# Altium schematic sheet MCU.SchDoc
size A3; SheetNumber: 9; SheetTotal: 9
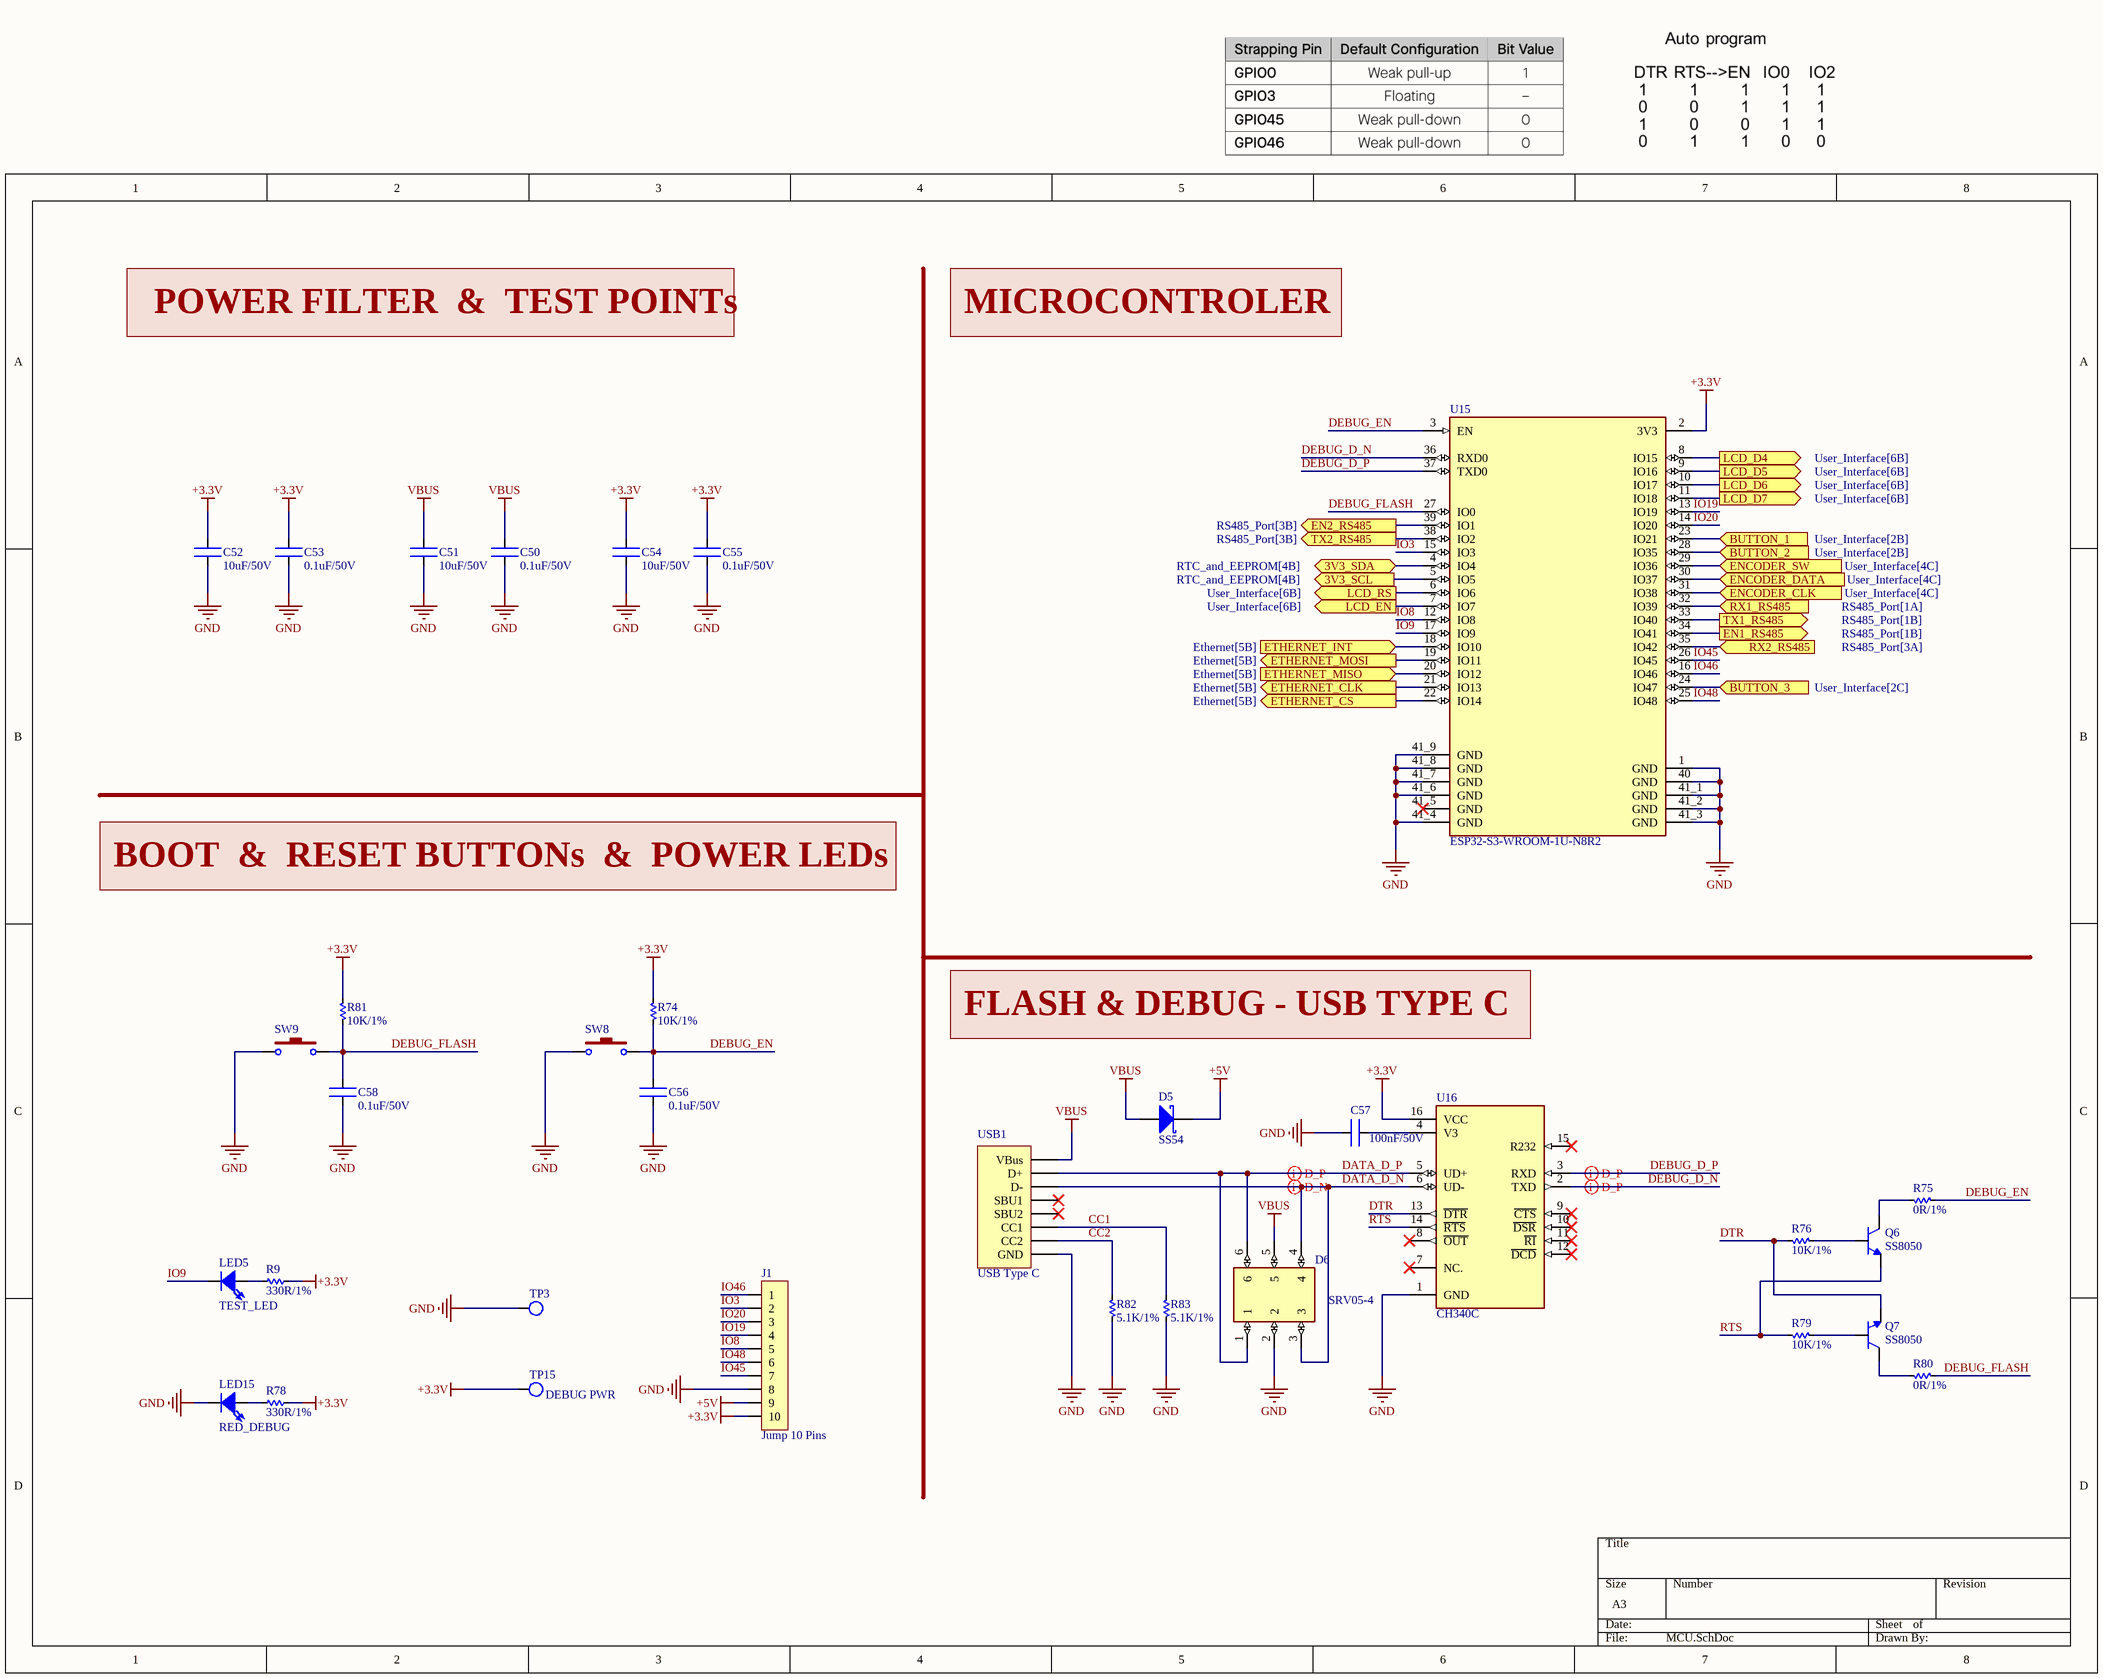
[diagram p0: MCU.SchDoc]

## Parts
C50  0.1uF/50V  [CAP - 0603]
C51  10uF/50V  [CAP - 0603]
C52  10uF/50V  [CAP - 0603]
C53  0.1uF/50V  [CAP - 0603]
C54  10uF/50V  [CAP - 0603]
C55  0.1uF/50V  [CAP - 0603]
C56  0.1uF/50V  [CAP - 0603]
C57  100nF/50V  [CAP - 0603]
C58  0.1uF/50V  [CAP - 0603]
D5  SS54  [SS54]
D6  SRV05-4  [SOT-23-6]
J1  Jump 10 Pins  [JPx1-10pins-2.54mm]
LED5  TEST_LED  [RED_LED_0603]
LED15  RED_DEBUG  [RED_LED_0603]
Q6  SS8050  [SOT23-3]
Q7  SS8050  [SOT23-3]
R9  330R/1%  [RES - 0603]
R74  10K/1%  [RES - 0603]
R75  0R/1%  [RES - 0603]
R76  10K/1%  [RES - 0603]
R78  330R/1%  [RES - 0603]
R79  10K/1%  [RES - 0603]
R80  0R/1%  [RES - 0603]
R81  10K/1%  [RES - 0603]
R82  5.1K/1%  [RES - 0603]
R83  5.1K/1%  [RES - 0603]
SW8  Button 2 Pins  [SMD SWITCH 2 PINS]  (value not drawn)
SW9  Button 2 Pins  [SMD SWITCH 2 PINS]  (value not drawn)
TP3  DEBUG PWR  [Test Point]  (value not drawn)
TP15  DEBUG PWR  [Test Point]
U15  ESP32-S3-WROOM-1U-N8R2  [ESP32-S3-WROOM-1U-N8R2]
U16  CH340C  [SOIC127P600X180-16N]
USB1  USB Type C  [Type-C-16Pins]

## Ports
3V3_SCL (out, see RTC_and_EEPROM[4B]), 3V3_SDA (bidir, see RTC_and_EEPROM[4B]), BUTTON_1 (in, see User_Interface[2B]), BUTTON_2 (in, see User_Interface[2B]), BUTTON_3 (in, see User_Interface[2C]), EN1_RS485 (out, see RS485_Port[1B]), EN2_RS485 (out, see RS485_Port[3B]), ENCODER_CLK (in, see User_Interface[4C]), ENCODER_DATA (in, see User_Interface[4C]), ENCODER_SW (in, see User_Interface[4C]), ETHERNET_CLK (out, see Ethernet[5B]), ETHERNET_CS (out, see Ethernet[5B]), ETHERNET_INT (in, see Ethernet[5B]), ETHERNET_MISO (in, see Ethernet[5B]), ETHERNET_MOSI (out, see Ethernet[5B]), LCD_D4 (out, see User_Interface[6B]), LCD_D5 (out, see User_Interface[6B]), LCD_D6 (out, see User_Interface[6B]), LCD_D7 (out, see User_Interface[6B]), LCD_EN (out, see User_Interface[6B]), LCD_RS (out, see User_Interface[6B]), RX1_RS485 (in, see RS485_Port[1A]), RX2_RS485 (in, see RS485_Port[3A]), TX1_RS485 (out, see RS485_Port[1B]), TX2_RS485 (out, see RS485_Port[3B])

## Nets
+3.3V: C52.2 C53.2 C54.2 C55.2 J1.10 R9.1 R74.2 R78.1 R81.1 TP15.1 U15.2(3V3) U16.16(VCC)
+5V: D5.2(K) J1.9
GND: C50.1 C51.1 C52.1 C53.1 C54.1 C55.1 C56.1 C57.1 C58.1 D6.2 J1.8 LED15.2 R82.2 R83.2 SW8.1 SW9.1 TP3.1 U15.1(GND) U15.40(GND) U15.41_1(GND) U15.41_2(GND) U15.41_3(GND) U15.41_4(GND) U15.41_6(GND) U15.41_7(GND) U15.41_8(GND) U15.41_9(GND) U16.1(GND) USB1.A1,B1,SHIELD(GND)
VBUS: C50.2 C51.2 D5.1(A) D6.5 USB1.A4,B4(VBus)
3V3_SCL: U15.5(IO5) ; port 3V3_SCL
3V3_SDA: U15.4(IO4) ; port 3V3_SDA
BUTTON_1: U15.23(IO21) ; port BUTTON_1
BUTTON_2: U15.28(IO35) ; port BUTTON_2
BUTTON_3: U15.24(IO47) ; port BUTTON_3
CC1: R83.1 USB1.A5(CC1)
CC2: R82.1 USB1.B5(CC2)
DATA_D_N: D6.3 D6.4 U16.6(UD-) USB1.A7,B7(D-)
DATA_D_P: D6.1 D6.6 U16.5(UD+) USB1.A6,B6(D+)
DEBUG_D_N: U15.36(RXD0) U16.2(TXD)
DEBUG_D_P: U15.37(TXD0) U16.3(RXD)
DEBUG_EN: C56.2 R74.1 R75.1 SW8.2 U15.3(EN)
DEBUG_FLASH: C58.2 R80.1 R81.2 SW9.2 U15.27(IO0)
DTR: Q7.2(E) R76.1 U16.13(~{DTR})
EN1_RS485: U15.34(IO41) ; port EN1_RS485
EN2_RS485: U15.39(IO1) ; port EN2_RS485
ENCODER_CLK: U15.31(IO38) ; port ENCODER_CLK
ENCODER_DATA: U15.30(IO37) ; port ENCODER_DATA
ENCODER_SW: U15.29(IO36) ; port ENCODER_SW
ETHERNET_CLK: U15.21(IO13) ; port ETHERNET_CLK
ETHERNET_CS: U15.22(IO14) ; port ETHERNET_CS
ETHERNET_INT: U15.18(IO10) ; port ETHERNET_INT
ETHERNET_MISO: U15.20(IO12) ; port ETHERNET_MISO
ETHERNET_MOSI: U15.19(IO11) ; port ETHERNET_MOSI
IO3: J1.2 U15.15(IO3)
IO8: J1.5 U15.12(IO8)
IO9: LED5.2 U15.17(IO9)
IO19: J1.4 U15.13(IO19)
IO20: J1.3 U15.14(IO20)
IO45: J1.7 U15.26(IO45)
IO46: J1.1 U15.16(IO46)
IO48: J1.6 U15.25(IO48)
LCD_D4: U15.8(IO15) ; port LCD_D4
LCD_D5: U15.9(IO16) ; port LCD_D5
LCD_D6: U15.10(IO17) ; port LCD_D6
LCD_D7: U15.11(IO18) ; port LCD_D7
LCD_EN: U15.7(IO7) ; port LCD_EN
LCD_RS: U15.6(IO6) ; port LCD_RS
RTS: Q6.2(E) R79.1 U16.14(~{RTS})
RX1_RS485: U15.32(IO39) ; port RX1_RS485
RX2_RS485: U15.35(IO42) ; port RX2_RS485
TX1_RS485: U15.33(IO40) ; port TX1_RS485
TX2_RS485: U15.38(IO2) ; port TX2_RS485
NetC57_2: C57.2 U16.4(V3)
NetLED5_1: LED5.1 R9.2
NetLED15_1: LED15.1 R78.2
NetQ6_1: Q6.1(B) R76.2
NetQ6_3: Q6.3(C) R75.2
NetQ7_1: Q7.1(B) R79.2
NetQ7_3: Q7.3(C) R80.2

Not connected (* = marked no-connect by the designer): U15 41_5(GND)*; U16 7(NC.)* 8(~{OUT})* 9(~{CTS})* 10(~{DSR})* 11(~{RI})* 12(~{DCD})* 15(R232)*; USB1 A8(SBU1)* B8(SBU2)*

## Layout directives
differential pair: DATA_D_N, DATA_D_P, DEBUG_D_N, DEBUG_D_P

## Notes on the sheet
- POWER FILTER  &  TEST POINTs
- MICROCONTROLER
- BOOT  &  RESET BUTTONs  &  POWER LEDs
- FLASH & DEBUG - USB TYPE C

## Library data of the parts
C50-C58 = CAPACITOR: CAPACITOR SMD - KEMET
D5 = SS54: DIODE SCHOTTKY 40V 5A SMA; Supplier 1: Newark; Supplier Part Number 1: 08X3002
D6 = SRV05-4: 17.5V Clamp 12A (8/20µs) Ipp Tvs Diode Surface Mount SOT-23-6
LED5 LED15 = LED_SMD: LED SMD
Q6 Q7 = SS8050: Bipolar (BJT) Transistor NPN 25 V 1.5 A 100MHz 300 mW Surface Mount SOT-23-3
R9 R74-R76 R78-R83 = RESISTOR: Resistor SMD - YAGEO
SW8 SW9 = Button 2 Pins: SMD Button; Supplier 1: Newark; Supplier Part Number 1: 35AH5160
TP3 TP15 = TEST POINT: Supplier Part Number 1: 36-5014-ND; Supplier 1: Digikey
U15 = ESP32-S3-WROOM-1U-N8R2: Bluetooth, WiFi 802.11b/g/n, Bluetooth v5.0 Transceiver Module 2.4GHz Antenna Not Included, U.FL Surface Mount
U16 = CH340C: USB to serial chip CH340
USB1 = USB Type C: Type 16 Pins (Include 4 GND Pins)